# EAGLE design vps-r2.0-20-with-description (EAGLE 6.6.0)
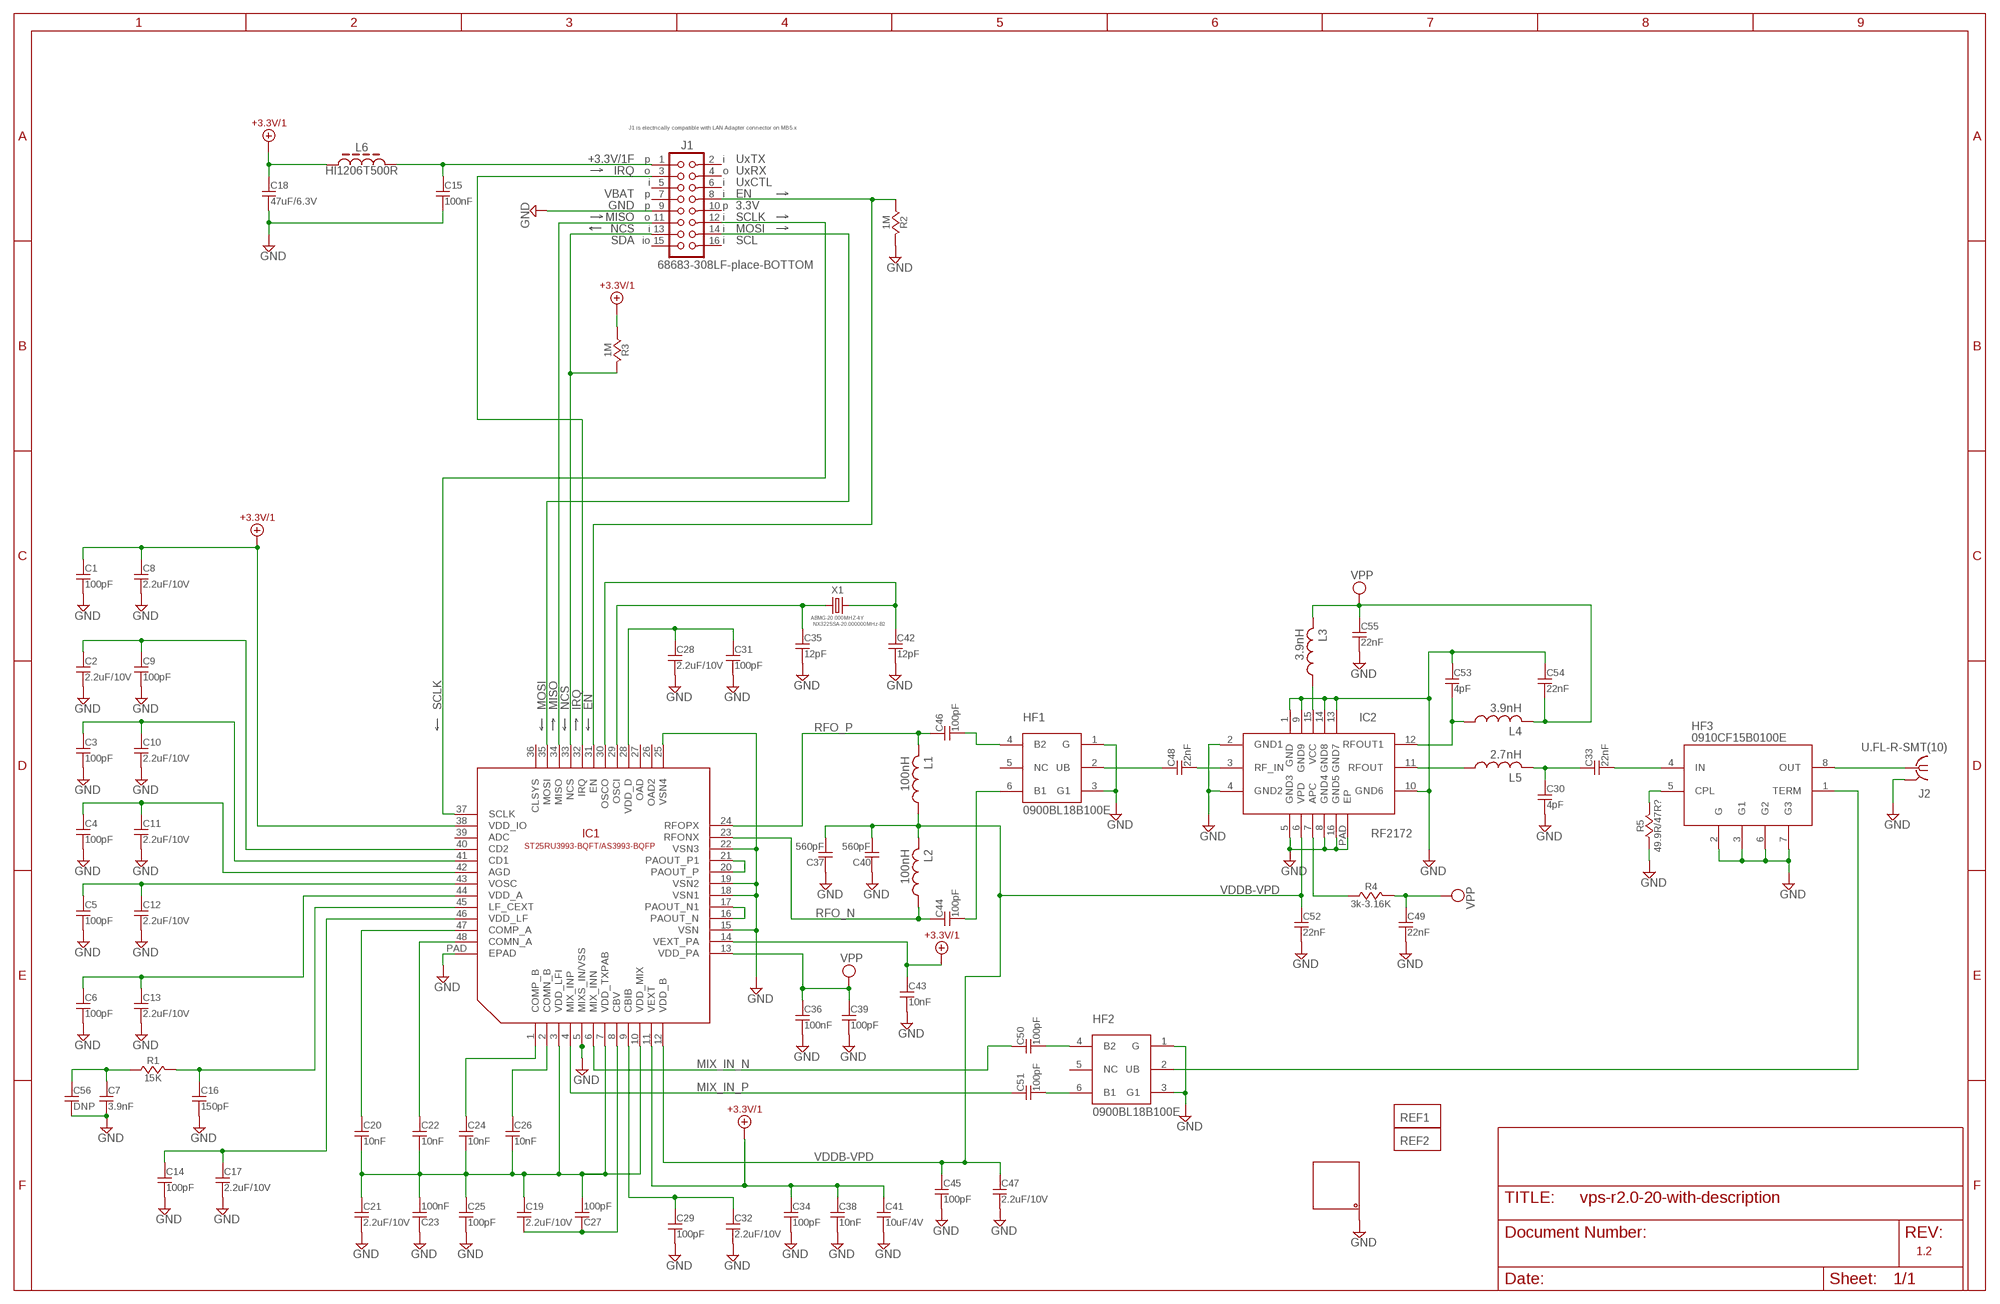
[diagram p0: schematic, sheet 1]

## Parts
C1  100pF  C-0603  [0603]
C2  2.2uF/10V  C-0603  [0603]
C3  100pF  C-0603  [0603]
C4  100pF  C-0603  [0603]
C5  100pF  C-0603  [0603]
C6  100pF  C-0603  [0603]
C7  3.9nF  C-0603  [0603]
C8  2.2uF/10V  C-0603  [0603]
C9  100pF  C-0603  [0603]
C10  2.2uF/10V  C-0603  [0603]
C11  2.2uF/10V  C-0603  [0603]
C12  2.2uF/10V  C-0603  [0603]
C13  2.2uF/10V  C-0603  [0603]
C14  100pF  C-0603  [0603]
C15  100nF  C-0603  [0603]
C16  150pF  C-0603  [0603]
C17  2.2uF/10V  C-0603  [0603]
C18  47uF/6.3V  C-1206  [1206]
C19  2.2uF/10V  C-0603  [0603]
C20  10nF  C-0603  [0603]
C21  2.2uF/10V  C-0603  [0603]
C22  10nF  C-0603  [0603]
C23  100nF  C-0603  [0603]
C24  10nF  C-0603  [0603]
C25  100pF  C-0603  [0603]
C26  10nF  C-0603  [0603]
C27  100pF  C-0603  [0603]
C28  2.2uF/10V  C-0603  [0603]
C29  100pF  C-0603  [0603]
C30  4pF  C-0603  [0603]
C31  100pF  C-0603  [0603]
C32  2.2uF/10V  C-0603  [0603]
C33  22nF  C-0603  [0603]
C34  100pF  C-0603  [0603]
C35  12pF  C-0603  [0603]
C36  100nF  C-0603  [0603]
C37  560pF  C-0603  [0603]
C38  10nF  C-0603  [0603]
C39  100pF  C-0603  [0603]
C40  560pF  C-0603  [0603]
C41  10uF/4V  C-0603  [0603]
C42  12pF  C-0603  [0603]
C43  10nF  C-0603  [0603]
C44  100pF  C-0603  [0603]
C45  100pF  C-0603  [0603]
C46  100pF  C-0603  [0603]
C47  2.2uF/10V  C-0603  [0603]
C48  22nF  C-0603  [0603]
C49  22nF  C-0603  [0603]
C50  100pF  C-0603  [0603]
C51  100pF  C-0603  [0603]
C52  22nF  C-0603  [0603]
C53  4pF  C-0603  [0603]
C54  22nF  C-0603  [0603]
C55  22nF  C-0603  [0603]
C56  DNP  C-0603  [0603]
HF1  0900BL18B100E  JTI_BALUN  [JTIBALUN]
HF2  0900BL18B100E  JTI_BALUN  [JTIBALUN]
HF3  0910CF15B0100E  JTI_CLP_FIL  [JTICPL]
IC1  ST25RU3993-BQFT/AS3993-BQFP  AS3993-BQFP  [LFCSP_7X7_48]
IC2  RF2172  [QFN164X4]
J1  68683-308LF-place-BOTTOM  MA08-2  [MA08-2]
J2  U.FL-R-SMT(10)  MC-921  [MC-921]
L1  100nH  L0603  [L0603]
L2  100nH  L0603  [L0603]
L3  3.9nH  L0603  [L0603]
L4  3.9nH  L0603  [L0603]
L5  2.7nH  L0603  [L0603]
L6  HI1206T500R  L-1206  [1206]
PCB1  PCB-VPS-1  [PCB-VPS]
R1  15K  R-0603  [0603]
R2  1M  R-0603  [0603]
R3  1M  R-0603  [0603]
R4  3k-3.16K  R-0603  [0603]
R5  49.9R/47R?  R-0603  [0603]
REF1  REF  [REF]
REF2  REF  [REF]
X1  ABMG-20.000MHZ-4Y  XTAL-7M  [7M]

## Nets
+3.3V/1: C1.1 C8.1 C18.1 C34.1 C38.1 C41.1 C43.1 IC1.11(VEXT) IC1.14(VEXT_PA) IC1.38(VDD_IO) L6.1 R3.1
+3.3V/1F: C15.1 J1.1 L6.2
APC: IC2.7(APC) R4.1
EN: IC1.31(EN) J1.8 R2.1
GND: C1.2 C2.2 C3.2 C4.2 C5.2 C6.2 C7.2 C8.2 C9.2 C10.2 C11.2 C12.2 C13.2 C14.2 C15.2 C16.2 C17.2 C18.2 C21.2 C23.1 C25.2 C28.2 C29.2 C30.2 C31.2 C32.2 C34.2 C35.2 C36.2 C37.1 C38.2 C39.2 C40.1 C41.2 C42.2 C43.2 C45.2 C47.2 C49.2 C52.2 C53.1 C54.1 C55.2 C56.2 HF1.1(G) HF1.3(G1) HF2.1(G) HF2.3(G1) HF3.2(G) HF3.3(G1) HF3.6(G2) HF3.7(G3) IC1.5(MIXS_IN/VSS) IC1.15(VSN) IC1.18(VSN1) IC1.19(VSN2) IC1.22(VSN3) IC1.25(VSN4) IC1.PAD(EPAD) IC2.1(GND) IC2.2(GND1) IC2.4(GND2) IC2.5(GND3) IC2.8(GND4) IC2.9(GND9) IC2.10(GND6) IC2.13(GND7) IC2.14(GND8) IC2.16(GND5) IC2.PAD(EP) J1.9 J2.2@1(GND) J2.2@2(GND) PCB1.VPS_PCB_1 R2.2 R5.1
IRQ: IC1.32(IRQ) J1.3
MISO: IC1.34(MISO) J1.11
MIX_IN_N: C50.1 IC1.6(MIX_INN)
MIX_IN_P: C51.1 IC1.4(MIX_INP)
MOSI: IC1.35(MOSI) J1.14
N$2: C7.1 C56.1 R1.1
N$3: C16.1 IC1.45(LF_CEXT) R1.2
N$4: C20.1 IC1.47(COMP_A)
N$5: C22.1 IC1.48(COMN_A)
N$8: C24.1 IC1.1(COMP_B)
N$9: C26.1 IC1.2(COMN_B)
N$11: C6.1 C13.1 IC1.44(VDD_A)
N$12: C5.1 C12.1 IC1.43(VOSC)
N$13: C19.2 C27.1 IC1.8(CBV)
N$14: C4.1 C11.1 IC1.42(AGD)
N$15: C14.1 C17.1 IC1.46(VDD_LF)
N$16: C3.1 C10.1 IC1.41(CD1)
N$17: C2.1 C9.1 IC1.40(CD2)
N$18 [100Ohm]: C51.2 HF2.6(B1)
N$19: C29.1 C32.1 IC1.9(CBIB)
N$22: C35.1 IC1.29(OSCI) X1.1
N$23: C42.1 IC1.30(OSCO) X1.3
N$24: IC1.20(PAOUT_P) IC1.21(PAOUT_P1)
N$25: IC1.16(PAOUT_N) IC1.17(PAOUT_N1)
N$29: C30.1 C33.1 L5.2
N$35: C33.2 HF3.4(IN)
N$39 [100Ohm]: C46.2 HF1.4(B2)
N$40: HF3.5(CPL) R5.2
N$41 [100Ohm]: C44.2 HF1.6(B1)
N$42: C48.1 HF1.2(UB)
N$44: HF2.2(UB) HF3.1(TERM)
N$46: HF3.8(OUT) J2.1
N$51: C28.1 C31.1 IC1.28(VDD_D)
N$52 [100Ohm]: C50.2 HF2.4(B2)
NCS: IC1.33(NCS) J1.13 R3.2
RFIN: C48.2 IC2.3(RF_IN)
RFO_N: C44.1 IC1.23(RFONX) L2.1
RFO_P: C46.1 IC1.24(RFOPX) L1.2
RFOUT: IC2.11(RFOUT) L5.1
RFOUT1: C53.2 IC2.12(RFOUT1) L4.1
SCLK: IC1.37(SCLK) J1.12
VDD-FLI-MIX-TXPAB: C19.1 C20.2 C21.1 C22.2 C23.2 C24.2 C25.1 C26.2 C27.2 IC1.3(VDD_LFI) IC1.7(VDD_TXPAB) IC1.10(VDD_MIX)
VDDB-VPD: C37.2 C40.2 C45.1 C47.1 C52.1 IC1.12(VDD_B) IC2.6(VPD) L1.1 L2.2
VPP: C36.1 C39.1 C49.1 C54.2 C55.1 IC1.13(VDD_PA) L3.2 L4.2 R4.2
VPP3,9NH: IC2.15(VCC) L3.1
Unconnected: HF1.5(NC) HF2.5(NC) IC1.26(OAD2) IC1.27(OAD) IC1.36(CLSYS) IC1.39(ADC) J1.2 J1.4 J1.5 J1.6 J1.7 J1.10 J1.15 J1.16

## Notes on the sheet
- J1 is electrically compatible with LAN Adapter connector on MB5.x
- p | i | UxTX
- o | o | UxRX
- i | i | UxCTL
- VBAT | p | i
- p | p | 3.3V
- o | i
- i | i
- SDA | io | i | SCL
- NX3225SA-20.000000MHz-B2
- 1.2

## Library data of the parts
C1-C17 C19-C56 = discrete:C-0603
C18 = discrete:C-1206: Capacitor 1206
HF1 HF2 = kits:JTI_BALUN: JTI 1:2 BALUN; DIGIKEY: 712-1023-1-ND; MF: JOHANSON TECHNOLIGIES; MPN: 0900BL18B100E
HF3 = JohansonTech-U:JTI_CLP_FIL: JTI 10dB CPLR/FILTER
IC1 = AustriaMicro-U:AS3993: RFID READER
IC2 = Rfmd-U:RF2172: RF PPOWER AMP
J1 = CON-pinHeader-AON:MA08-2
J2 = con-coax:MC-921: COAX. MICROWAVE CONNECTOR O/D diam 2.1 Source: www.tycoelectronics.com .. Electronics .. ENG_CD_1775146_A2.pdf; OC_FARNELL: unknown; OC_NEWARK: unknown
L1-L5 = kits:L0603
L6 = discrete:L-1206
PCB1 = ACB:PCB-VPS
R1-R5 = discrete:R-0603
REF1 REF2 = technol:REF
X1 = TXC_Tech-U:XTAL

## Net classes
0 default: width 0.2 mm, drill 0.3 mm, clearance 0.2 mm
1 100Ohm: width 0.4 mm, clearance 0.178 mm

## Board
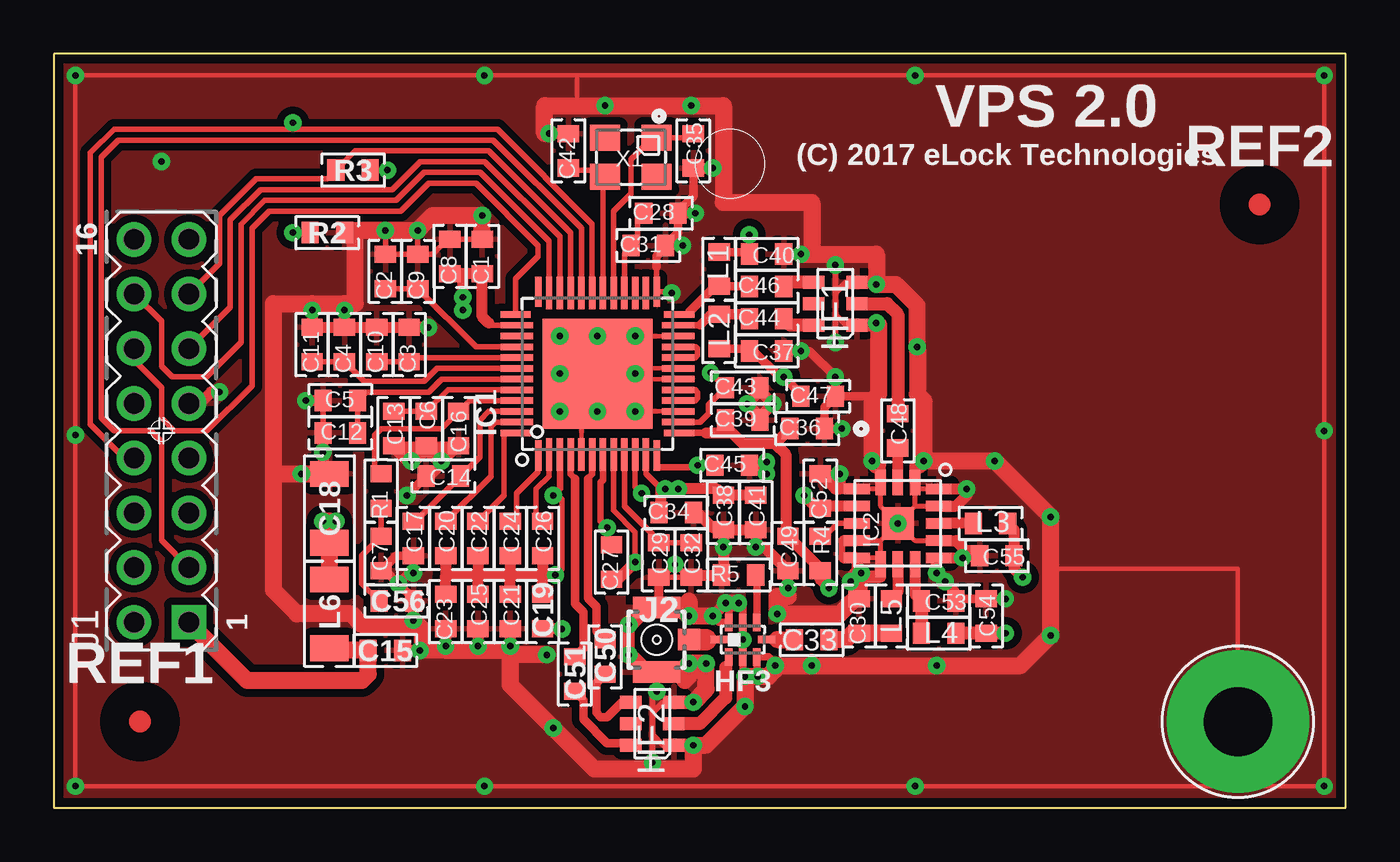
[diagram p1: board, top side]
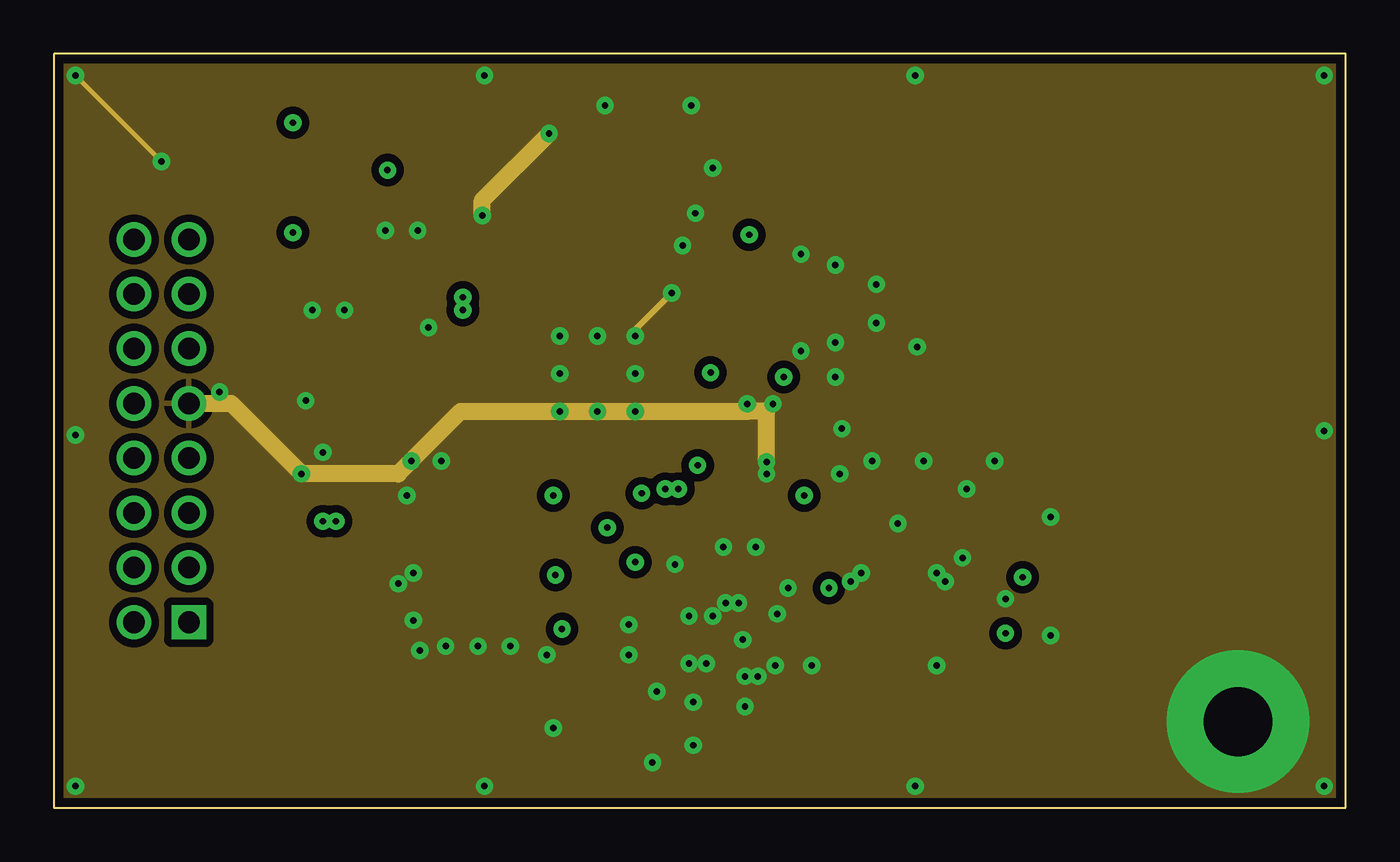
[diagram p2: board, inner layer Route2-GND]
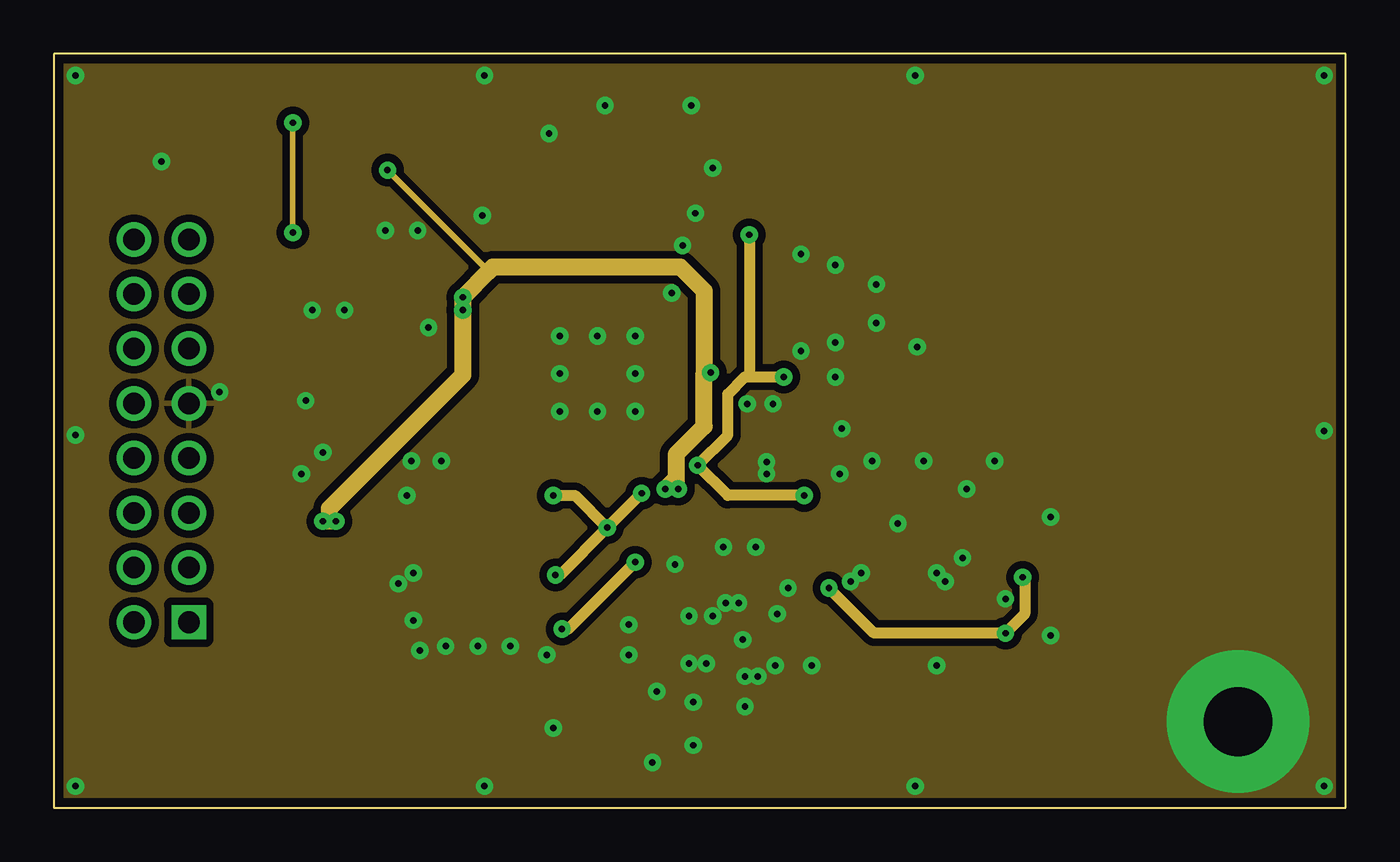
[diagram p3: board, inner layer Route15]
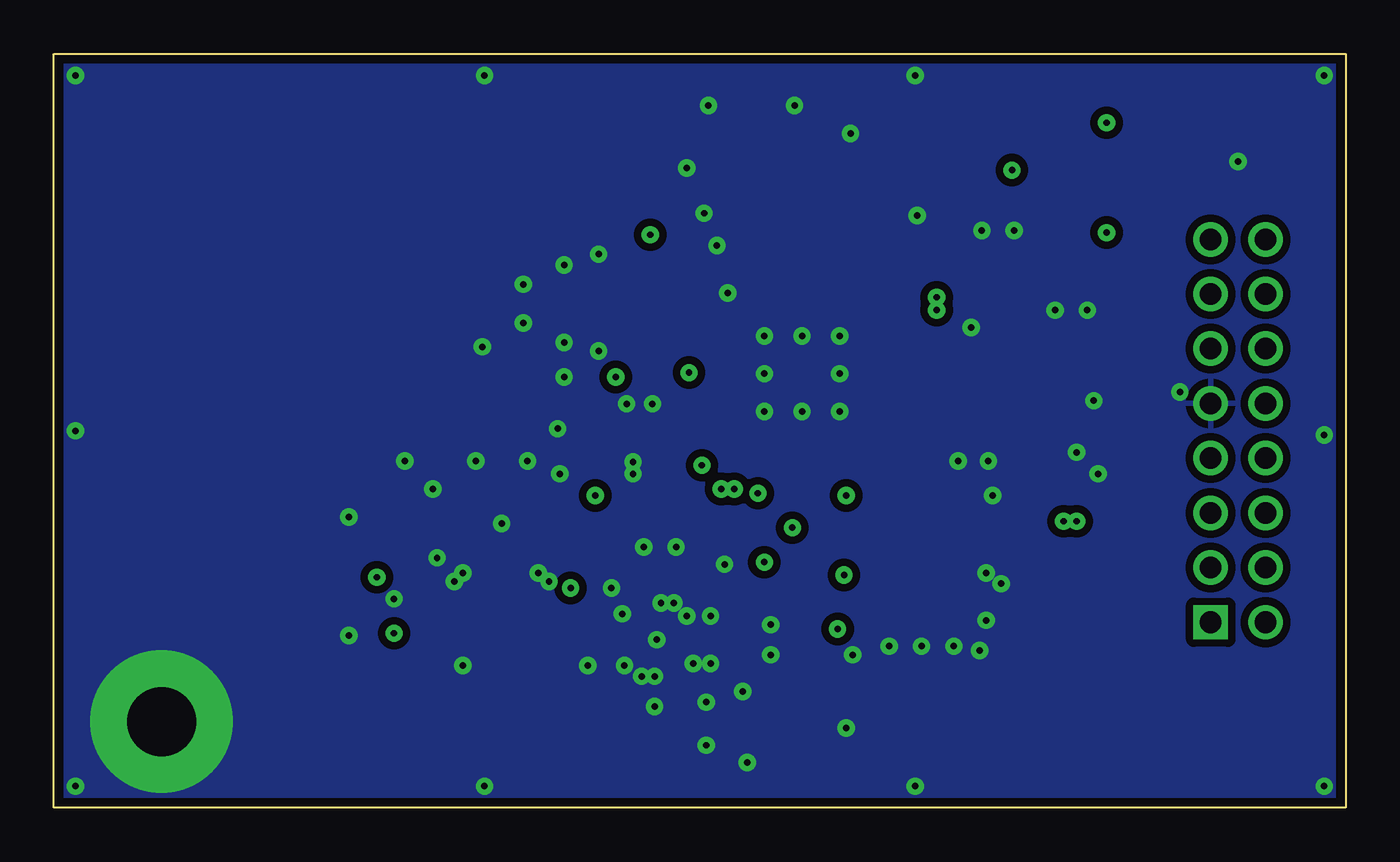
[diagram p4: board, bottom side, seen from below]

Size 60 x 35 mm. Coordinates in mm from the lower left corner, seen from the top.
Outline: 0,0 60,0 60,35 0,35 0,0
Copper layers ((1*2)+(15*16)): Top 0.035mm / dielectric 0.36mm / Route2-GND 0.035mm / dielectric 0.71mm / Route15 0.035mm / dielectric 0.36mm / Bottom 0.035mm
Design rules "default *": minimum track width 0.2mm, minimum drill 0.2mm, track to track 0.2mm, track to pad 0.2mm, pad to pad 0.2mm, via to via 0.2mm, smd to smd 0.001mm, copper to edge 0.4mm, drill to drill 0.25mm, minimum pad ring 0.25mm, minimum via ring 0.25mm, stop-mask expansion 4mil, vias tented up to drill 0.6mm, thermal gap 0.35mm

### Footprints (pad centres in the part's own frame; a part is rotated, then mirrored left to right if it is on the bottom)
0603 = smd 0.79 x 0.99: 1 -0.8,0; 2 0.8,0
1206 = smd 1.19 x 1.79: 1 -1.6,0; 2 1.6,0
JTIBALUN = smd 0.59 x 0.99: 1 1,1; 2 0,1; 3 -1,1; 4 -1,-1; 5 0,-1; 6 1,-1
JTICPL = smd 0.35 x 0.799: 1 0.65,0.8; 2 0,0.8; 3 -0.65,0.8; 5 -0.65,-0.8; 6 0,-0.8; 7 0.65,-0.8 | smd 0.799 x 0.35: 4 -1.1,0; 8 1.1,0
LFCSP_7X7_48 = smd 0.3 x 1.4: 1 -2.75,-3.8; 12 2.75,-3.8; 25 2.75,3.8; 36 -2.75,3.8 | smd 0.3 x 1.5: 2 -2.25,-3.75; 3 -1.75,-3.75; 4 -1.25,-3.75; 5 -0.75,-3.75; 6 -0.25,-3.75; 7 0.25,-3.75; 8 0.75,-3.75; 9 1.25,-3.75; 10 1.75,-3.75; 11 2.25,-3.75; 26 2.25,3.75; 27 1.75,3.75; 28 1.25,3.75; 29 0.75,3.75; 30 0.25,3.75; 31 -0.25,3.75; 32 -0.75,3.75; 33 -1.25,3.75; 34 -1.75,3.75; 35 -2.25,3.75 | smd 1.4 x 0.3: 13 3.8,-2.75; 24 3.8,2.75; 37 -3.8,2.75; 48 -3.8,-2.75 | smd 1.5 x 0.3: 14 3.75,-2.25; 15 3.75,-1.75; 16 3.75,-1.25; 17 3.75,-0.75; 18 3.75,-0.25; 19 3.75,0.25; 20 3.75,0.75; 21 3.75,1.25; 22 3.75,1.75; 23 3.75,2.25; 38 -3.75,2.25; 39 -3.75,1.75; 40 -3.75,1.25; 41 -3.75,0.75; 42 -3.75,0.25; 43 -3.75,-0.25; 44 -3.75,-0.75; 45 -3.75,-1.25; 46 -3.75,-1.75; 47 -3.75,-2.25 | smd 5.1 x 5.1: PAD 0,0
QFN164X4 = smd 0.49 x 1.19: 1 -1.6,1.9; 5 -1.6,-1.9; 6 -0.8,-1.9; 7 0,-1.9; 8 0.8,-1.9; 9 1.6,-1.9; 13 1.6,1.9; 14 0.8,1.9; 15 0,1.9; 16 -0.8,1.9 | smd 1.19 x 0.49: 2 -1.9,0.8; 3 -1.9,0; 4 -1.9,-0.8; 10 1.9,-0.8; 11 1.9,0; 12 1.9,0.8 | smd 1.5 x 1.5: PAD 0,0
MA08-2 = drill 1 pad 1.6 square: 1 -8.89,-1.27 | drill 1 pad 1.6: 2 -8.89,1.27; 3 -6.35,-1.27; 4 -6.35,1.27; 5 -3.81,-1.27; 6 -3.81,1.27; 7 -1.27,-1.27; 8 -1.27,1.27; 9 1.27,-1.27; 10 1.27,1.27; 11 3.81,-1.27; 12 3.81,1.27; 13 6.35,-1.27; 14 6.35,1.27; 15 8.89,-1.27; 16 8.89,1.27
MC-921 = smd 1 x 1: 1 0,1.5 | smd 0.99 x 2.19: 2@1 -1.5,0; 2@2 1.5,0
L0603 = smd 0.79 x 0.99: 1 -0.8,0; 2 0.8,0
PCB-VPS = drill 3.2 pad 6.6: VPS_PCB_1 55,4
7M = smd 1.399 x 1.199: 1 -1.2,-0.9; 2 1.2,-0.9; 3 1.2,0.9; 4 -1.2,0.9

### Placement (x,y rotation side)
C1  19.9,25.6 90 top
C2  15.4,24.9 90 top
C3  16.5,21.5 90 top
C4  13.5,21.5 90 top
C5  13.3,18.9 180 top
C6  17.3,17.6 270 top
C7  15.2,11.8 270 top
C8  18.4,25.6 90 top
C9  16.9,24.9 90 top
C10  15,21.5 90 top
C11  12,21.5 90 top
C12  13.3,17.4 180 top
C13  15.8,17.6 270 top
C14  18.1,15.4 180 top
C15  15.4,7.3 0 top
C16  18.8,17.6 270 top
C17  16.7,12.5 270 top
C18  12.8,13.9 90 top
C19  22.7,9.1 270 top
C20  18.2,12.5 270 top
C21  21.2,9.1 270 top
C22  19.7,12.5 270 top
C23  18.2,9.1 90 top
C24  21.2,12.5 270 top
C25  19.7,9.1 270 top
C26  22.7,12.5 270 top
C27  25.9,11.4 90 top
C28  28.2,27.6 0 top
C29  28.1,11.5 270 top
C30  37.4,8.9 90 top
C31  27.6,26.1 0 top
C32  29.6,11.5 270 top
C33  35.2,7.8 180 top
C34  28.9,13.7 0 top
C35  29.7,30.5 270 top
C36  35,17.6 0 top
C37  33.1,21.2 180 top
C38  31.1,13.7 270 top
C39  32,18 0 top
C40  33.1,25.7 180 top
C41  32.6,13.7 270 top
C42  23.9,30.5 90 top
C43  32,19.5 0 top
C44  33.1,22.7 0 top
C45  31.5,15.9 0 top
C46  33.1,24.2 0 top
C47  35.5,19.1 0 top
C48  39.2,17.5 270 top
C49  34.1,11.8 270 top
C50  25.6,7 270 top
C51  24.2,6.2 270 top
C52  35.6,14.7 90 top
C53  41.1,9.6 180 top
C54  43.3,8.9 270 top
C55  43.8,11.7 180 top
C56  15.9,9.6 0 top
HF1  36.3,23.4 270 top
HF2  27.8,3.9 270 top
HF3  32,7.8 180 top
IC1  25.25,20.15 0 top
IC2  39.2,13.2 270 top
J1  5,17.5 90 top
J2  28,7.8 270 top
L1  30.9,25 270 top
L2  30.9,22.1 270 top
L3  43.5,13.2 0 top
L4  41.1,8.1 0 top
L5  38.9,8.9 270 top
L6  12.8,9 270 top
PCB1  0,0 0 top
R1  15.2,14.7 90 top
R2  12.7,26.7 0 top
R3  13.9,29.6 180 top
R4  35.6,11.8 270 top
R5  31.8,10.8 0 top
REF1  4,4 0 top
REF2  56,28 0 top
X1  26.8,30.2 180 top

### Tracks (layer width: path | path; a pad name or v marks a point on that pad's centre or on a via)
+3.3V/1  (via drill 0.3 pad 0.8)
  Top 0.25: IC1.38 20.3,22.4 20.2,22.5 | IC1.11 27.5,15.5 28.2,14.8 | R3.1 v15.5,29.6 | IC1.14 30,17.9 30.4,18.3 30.4,18.7 C43.1 v30.5,20.2
  Top 0.5: C41.1 C38.1 30.8,14.8 v28.4,14.8 28.2,14.8 28.2,13.9 28.1,13.8 C34.1 | 19.91,24.8 C1.1 | C1.1 19,24.8 | 19,24.8 C8.1 | 20.2,22.5 19.9,22.8 C1.1 | 19,24.8 v19,23.7 v19,23.1
  Top 0.8: v13.1,13.3 v12.5,13.3 12.8,13.3 C18.1 L6.1
  Route15 0.25: v15.5,29.6 20.2,24.9
  Route15 0.8: 30.2,20.2 30.2,24 29.1,25.1 20.4,25.1 20.2,24.9 v19,23.7 19,20.1 12.8,13.9 12.8,13.3 | 30.2,20.2 v30.5,20.2 | 30.2,20.2 30.2,17.7 28.9,16.4 28.9,15.3 | v28.4,14.8 28.9,15.3 | 12.8,13.3 v12.5,13.3 | v13.1,13.3 12.8,13.3 | 28.9,15.3 28.9,14.9 v29,14.8
+3.3V/1F
  Top 0.8: J1.1 8.98,5.9 14.3,5.9 14.6,6.2 C15.1 12.9,7.3 L6.2
APC
  Top 0.2: 36,12.8 35.8,12.8 R4.1
  Top 0.25: IC2.7 36.4,13.2 36,12.8
EN  (via drill 0.3 pad 0.8)
  Top 0.25: IC1.31 25,27.1 20.6,31.5 11.1,31.5 | 11.1,31.5 2.8,31.5 1.7,30.4 1.7,17.8 3.27,16.23 J1.8 | R2.1 v11.1,26.7 | v11.1,31.8 11.1,31.5
  Route15 0.25: v11.1,26.7 v11.1,31.8
GND  (via drill 0.3 pad 0.8)
  Top 0.2: IC2.9 38.4,11.6 38.4,12.4 | IC2.8 38.4,12.4 | 38.4,12.4 IC2.PAD | IC2.14 40,12.4 IC2.PAD | IC2.4 38.4,14.8 | 38.4,14.8 38.4,14 IC2.PAD | IC2.2 40,14.8 | 40,14.8 40,14 | 40,14 IC2.PAD | IC2.5 38.4,14.8 | IC2.1 40,14.8 | IC2.16 40,14 | v37.5,10.9 38.4,10.9 | IC1.5 24.5,18.4 | IC1.15 v27,18.4 | IC1.19 27,20.4 | IC1.18 27,19.9 | IC1.22 v27,21.9 | PCB1.VPS_PCB_1 55,11.1 46.3,11.1 | 24.3,34 v20,34 v1,34 v1,17.3 v1,1 v20,1 v40,1 v59,1 v59,17.5 v59,34 v40,34 24.3,34 | 22.8,32.6 24.3,32.6 24.3,34
  Top 0.25: C12.2 C5.2 | C9.2 C2.2 v15.4,26.8 | C1.2 C8.2 18.3,26.4 17.6,25.7 C9.2 | v16.9,26.8 C9.2 | 28,25.1 IC1.25 28.65,23.95 v28.7,23.9 | 29.45,10.7 C29.2 28.25,10.7 v28.85,11.3 29.45,10.7 | 29,27.5 C28.2 29,27.7 | HF1.1 36.8,22.4 36.3,22.9 | 36.3,22.9 36.3,23.9 | 36.3,23.9 36.8,24.4 HF1.3 | 29.45,10.7 C32.2 | 28.39,25.99 28.39,26.09 C31.2 | 27.8,3.4 v27.8,2.1 27.8,1.8 | 27.8,3.4 27.8,4.4 | 27.8,4.4 27.8,5.2 v28,5.4 | 36.3,23.9 v36.3,25.2 | 36.3,22.9 v36.3,21.6 | 27.8,3.4 28.3,2.9 | 27.8,4.4 28.3,4.9
  Top 0.3: v25.25,18.4 24.5,18.4 v23.5,18.4 v23.5,20.15 v23.5,21.9 v25.25,21.9 v27,21.9 v27,20.15 | v27,20.15 27,19.9 v27,18.4 | 27,20.4 v27,20.15 | IC1.PAD v27,20.15 | C34.2 29.9,13.7 | 36.7,11.6 36.6,11.7 36.6,12.3 36.7,12.4
  Top 0.35: 32,6.2 HF3.2 v32,7.8 HF3.6 32,9.5 v31.8,9.5 | 31.35,9.5 HF3.7 | v30.6,8.9 30.9,8.6 31.3,8.6 | v33.5,6.6 33.5,6.7 33.2,7 HF3.3 32.65,6.15 v32.7,6.1 33,6.1 33.4,6.5
  Top 0.4: 28,25.1 28,25.6 28.39,25.99 | C55.2 42.7,12 42.3,12 42.2,12.1 v42.2,11.6 42.7,11.6 | 32.63,6.17 v32.7,6.1 | 32,6.2 v32.1,6.1 | v41,10.9 v41.4,10.5 41.9,10 41.9,9.7 C54.1 v44.2,9.7 | v37,10.5 37.4,10.5 | 29,27.5 29,26.7 C31.2 v29.2,26.1 | C35.2 29.7,28.4 29,27.7 | C37.1 v34.7,21.2 35.1,21.2 v36.3,20 C47.2 | v36.6,17.6 C36.2 35.8,18.6 C47.2 | C45.2 32.5,15.9 32.9,15.5 v33.1,15.5 | J2.2@1 28.1,9.3 C29.2 | C56.2 16.7,9.7 v16,10.4 | v16,10.4 15.4,11 C7.2 15.9,11.7 C17.2 v16.7,10.9 16.5,10.9 v16,10.4 | C13.2 C6.2 C16.2 | C47.2 38,19.1 38,18.9 | 41,11.6 IC2.13 | 32.9,15.9 32.95,15.9 v33.1,16.05 | v18,16.1 18,15.9 17.5,15.4 C14.2 v16.4,14.5
  Top 0.49: 38.4,15.9 38.2,16.1 v38,16.1 | 40,15.9 40.4,16.3
  Top 0.5: C23.1 v18.2,7.5 18.2,7.3 | C21.2 v21.2,7.5 21.2,7.3 | C25.2 v19.7,7.5 19.7,7.3 | C4.2 C11.2 v12,23.1 | C4.2 v13.5,23.1 | v17.4,22.3 C3.2 C10.2 C4.2 | C5.2 v11.7,18.9 | v16.7,8.7 C56.2 | 37.4,10.8 37.3,10.8 IC2.9 36.7,11.6 | IC2.13 v42.2,11.6 | IC2.14 41.9,12.4 42.2,12.1 | v31.2,9.5 v30.6,8.9 | 38.4,11.6 IC2.10 | v41,10.9 41,11.6 | IC2.5 36.5,14.8 | 36.5,14.8 36.3,14.8 35.85,15.25 | 35.85,15.25 C52.2 | C42.2 v23,31.3 | C35.2 v30.6,29.7 | IC2.4 38.4,15.9 | IC2.2 40,15.9 | 29.9,13.7 30.6,13 31,13 C38.2 | 32.8,18.15 v33.4,18.75 32.8,19.35 | C38.2 v31.1,12.1 31.1,10.8 R5.1 29.7,10.8 C32.2 | HF2.3 29.3,4.9 | HF2.1 29.3,2.9 | C38.2 C41.2 v32.6,12.1 33,12.1 C49.2 v34.1,10.2 34.1,9.8 | 12.5,15.5 v12.5,16.5 C12.2 | v29.8,27.6 C28.2 | 32.8,18.15 v32.2,18.75 32.8,19.35 | 32.8,18.15 C39.2 | 32.8,19.35 C43.2 | 32.9,15.9 C45.2 | 35.85,15.25 36.05,15.25 36.3,15.5 v36.5,15.5 36.5,14.8 | C15.2 v17,7.3 | C16.2 18.7,16.8 | C13.2 15.9,16.8 | C40.1 v34.7,25.7 | IC2.1 v42.4,14.8 42.4,14.5 41.9,14 IC2.16 | v7.7,19.3 7.3,19.3 6.77,18.77 J1.9 | v37.5,10.9 37.7,10.7 38.4,10.7 38.4,11.2 | 36.7,12.4 IC2.8
  Top 0.6: v26.7,7.1 v26.7,8.5 | v38.2,24.3 38.1,24.4 HF1.3 | v38.2,22.5 38.1,22.4 HF1.1 | 29.3,4.9 v29.7,4.9 | 29.3,2.9 v29.7,2.9 | 18.7,16.8 v18,16.1
  Top 0.8: C1.2 v19.9,27.5 17.6,27.5 v16.9,26.8 v15.4,26.8 14,26.8 14,26.7 | 10.2,15.5 10.2,23.4 12,23.4 | v12,23.1 12,23.4 | 12,23.4 13.5,23.4 | 14,26.7 14,23.4 13.5,23.4 | v38.2,22.5 38.3,22.4 38.3,19.2 38,18.9 v38,16.1 38.2,15.9 | v40.4,16.1 40.4,16.3 40.4,18.9 40.1,19.2 v40.1,21.4 40.1,23.3 39.1,24.3 v38.2,24.3 38.2,25.7 35.2,25.7 | v40.4,16.1 40.2,15.9 | v29.5,6.7 v30.3,6.7 30.3,5.5 v29.7,4.9 | v30.6,8.9 v29.5,8.9 | v26.7,7.1 27.5,6.3 27.55,6.3 27.57,6.33 27.98,6.33 J2.2@2 29.1,6.3 v29.5,6.7 | v26.7,8.5 27.5,9.3 J2.2@1 29.1,9.3 v29.5,8.9 | C53.1 41.9,9.7 | v13.5,23.1 13.5,23.4 | R2.2 14,26.7 | 29.5,9.6 v29.5,8.9 | 10.2,15.5 v11.5,15.5 12.5,15.5 C18.2 | v31.8,9.5 31.35,9.5 v31.2,9.5 | 34.1,9.8 33.6,9.8 v33.6,9 36.5,9 37.2,9.7 C30.2 37.4,10.5 37.4,10.8 v37.5,10.9 37.4,10.9 v37,10.5 | 17.1,7.3 18.2,7.3 19.7,7.3 21.2,7.3 21.2,7 | 17.1,7.3 17.1,8.3 v16.7,8.7 16.7,8.5 14.3,8.5 13.8,9 11.3,9 10.2,10.1 10.2,15.5 | 17.1,7.3 v17,7.3 | 15.9,16.8 v16.6,16.1 C6.2 v18,16.1 | v34.7,25.7 35.2,25.7 | v40.4,16.1 v43.7,16.1 v46.3,13.5 46.3,11.1 v46.3,8 44.9,6.6 v41,6.6 v35.2,6.6 33.7,6.6 33.2,6.1 v32.7,6.1 v32.1,6.1 v32.1,4.7 30.3,2.9 v29.7,2.9 29.7,1.8 27.8,1.8 25.1,1.8 v23.2,3.7 21.2,5.7 21.2,7 | v23,31.3 22.8,31.3 22.8,32.6 v25.6,32.6 v29.6,32.6 31.1,32.6 31.1,28.1 35.2,28.1 35.2,25.7 | v22.9,7.1 21.3,7.1 21.2,7 | v29.5,6.7 29.5,6.1 29.3,5.9
  Route2-GND 0.2: v5,30 v1,34
  Route2-GND 0.25: v28.7,23.9 27,22.2 v27,21.9
  Route2-GND 0.8: v19.9,27.5 19.9,28.2 v23,31.3 | J1.9 8.23,18.77 v11.5,15.5 16,15.5 v16.6,16.1 18.9,18.4 v27,18.4 32.2,18.4 | 32.2,18.4 v32.2,18.75 | v33.1,16.05 33.1,18.4 32.2,18.4
  other vias: 39.2,13.2
  pour Top (isolate 0.35): 0.5,0.5 0.5,34.5 59.5,34.5 59.5,0.5
  pour Route2-GND (isolate 0.35): 0.5,0.5 0.5,34.5 59.5,34.5 59.5,0.5
  pour Route15 (isolate 0.35): 0.5,0.5 0.5,34.5 59.5,34.5 59.5,0.5
  pour Bottom (isolate 0.35): 0.5,0.5 0.5,34.5 59.5,34.5 59.5,0.5
IRQ
  Top 0.25: IC1.32 24.5,26.9 20.4,31 3,31 2.2,30.2 2.2,18.1 2.8,17.5 4.5,17.5 5,17 5,12.42 J1.3
MISO
  Top 0.25: IC1.34 23.5,26.5 20,30 17,30 15.7,28.7 9.6,28.7 8.2,27.3 8.2,23.24 J1.11
MIX_IN_N
  Top 0.3: IC1.6 25,15.47 24.8,15.28
  Top 0.4: 24.8,15.28 24.8,9.72 25.2,9.33 25.2,8.2 C50.1
MIX_IN_P
  Top 0.3: IC1.4 24,15.47 24.2,15.28
  Top 0.4: 24.2,15.28 24.2,9.47 24.6,9.07 24.6,7.4 C51.1
MOSI
  Top 0.25: IC1.35 23,26.3 19.8,29.5 17.2,29.5 15.9,28.2 9.8,28.2 8.7,27.1 8.7,21.6 7.1,20 5.5,20 5,20.5 5,22.58 J1.14
N$2
  Top 0.25: R1.1 C7.1 14.3,11.7 14.3,10.4 C56.1
N$3
  Top 0.25: IC1.45 19.3,18.9 C16.1 18,17.6 15.2,17.6 14.9,17.3 14.9,16.3 14.9,16.09 14.9,15.8 R1.2
N$4
  Top 0.25: IC1.47 20.5,17.9 20.3,17.7 20.3,15.4 C20.1
N$5
  Top 0.25: IC1.48 20.9,17.4 20.9,14.5 C22.1
N$8
  Top 0.25: C24.1 21.1,13.4 21.5,13.4 21.5,14.6 22.5,15.6 IC1.1
N$9
  Top 0.25: IC1.2 23,15.4 22.4,14.8 22.4,13.6 C26.1
N$11
  Top 0.25: C13.1 C6.1 18.3,19.4 IC1.44
N$12
  Top 0.25: IC1.43 18,19.9 17.4,19.3 14.5,19.3 C5.1 C12.1
N$13  (via drill 0.3 pad 0.8)
  Top 0.25: IC1.8 26,13.8 27,12.8 v27,11.4
  Top 0.5: v23.6,8.3 C19.2 | C27.1 26.2,10.6 v27,11.4
  Route15 0.5: v23.6,8.3 23.9,8.3 v27,11.4
N$14
  Top 0.25: IC1.42 17.8,20.4 17.2,19.8 14.4,19.8 C4.1 C11.1
N$15
  Top 0.25: IC1.46 20.2,18.4 19.8,18 19.8,16.3 C14.1 16.8,13.3 C17.1
N$16
  Top 0.25: IC1.41 16.7,20.9 C3.1 C10.1
N$17
  Top 0.25: IC1.40 19.6,21.4 C9.1
  Top 0.254: C9.1 C2.1
N$18
  Top 0.4: C51.2 24.6,5 24.6,4.1 25.7,3 26.5,3 26.6,2.9 HF2.6
N$19
  Top 0.25: C32.1 C29.1 27.8,12.6 27.8,12.7 26.5,14 IC1.9
N$22
  Top 0.25: IC1.29 26,27.7 26.8,28.5 26.8,30.1 27.8,31.1 X1.1 29.5,31.1 C35.1
N$23
  Top 0.25: IC1.30 25.5,29.2 X1.3 25.3,29.6 24,29.6 C42.1
N$24
  Top 0.25: IC1.20 29.8,20.9 29.9,21 29.9,21.3 29.8,21.4 IC1.21
N$25
  Top 0.25: IC1.16 29.8,18.9 29.9,19 29.9,19.3 29.8,19.4 IC1.17
N$29
  Top 0.8: C33.1 36.8,7.8 37.1,8.1 C30.1 L5.2
N$35
  Top 0.35: HF3.4 33.6,7.8
  Top 0.8: 33.6,7.8 C33.2
N$39
  Top 0.6: HF1.4 34.1,24.4 C46.2
N$40
  Top 0.35: HF3.5 32.65,10.75 R5.2
N$41
  Top 0.6: HF1.6 34.2,22.4 C44.2
N$42
  Top 0.6: C48.1 39.2,22.9 38.7,23.4 HF1.2
N$44
  Top 0.35: HF3.1 31.35,6.65 31.2,6.5
  Top 0.5: 29.3,3.9 HF2.2
  Top 0.6: 31.2,6.5 31.2,5.1 30,3.9 29.3,3.9
N$46
  Top 0.35: HF3.8 30.5,7.8
  Top 0.6: 30.5,7.8 30.3,7.8
  Top 1: 30.3,7.8 J2.1
N$51
  Top 0.25: IC1.28 26.5,25.7 26.8,26 C31.1 27.1,26.4 27.1,27.2 27.4,27.5 C28.1
N$52
  Top 0.4: C50.2 25.2,5.8 25.2,4.4 25.4,4.2 25.7,4.2 26.4,4.9 HF2.4
NCS
  Top 0.25: IC1.33 24,26.7 20.2,30.5 14,30.5 R3.2 12.7,29.2 9.4,29.2 7.7,27.5 7.7,25.28 J1.13
RFIN
  Top 0.5: IC2.3 C48.2
RFO_N
  Top 0.3: IC1.23 30,22.4
  Top 0.4: 30,22.4 30.5,22.9 L2.1
  Top 0.48: L2.1 32.1,22.9 C44.1
RFO_P
  Top 0.3: IC1.24 29.5,22.9 29.5,23
  Top 0.4: 29.5,23 30.7,24.2 L1.2 C46.1
RFOUT
  Top 0.5: IC2.11 39.2,10 L5.1
RFOUT1
  Top 0.5: IC2.12 40,9.9 C53.2
  Top 0.6: C53.2 L4.1
SCLK
  Top 0.25: IC1.37 21.45,24.55 22.5,25.6 22.5,26.1 19.6,29 17.4,29 16.1,27.7 10,27.7 9.2,26.9 9.2,19.6 7.1,17.5 5.6,17.5 5,18.1 5,19.5 3.73,20.77 J1.12
VDD-FLI-MIX-TXPAB  (via drill 0.3 pad 0.8)
  Top 0.25: IC1.10 27,14.9 v27.3,14.6 | v23.3,10.8 23.6,11.1 23.6,14.3 23.4,14.5 v23.2,14.5 | v25.7,13 25.7,12.4 C27.2
  Top 0.3: IC1.7 25.5,15.2 25.4,15.1 25.4,13.3 v25.7,13 | IC1.3 23.5,14.8 v23.2,14.5
  Top 0.5: C25.1 19.7,10.8 | C23.2 18.2,10.8 | 19.7,10.8 21.2,10.8 | 18.2,10.8 19.7,10.8 | C20.2 18.2,10.8 | C22.2 19.7,10.8 | C21.1 21.2,10.8 | C24.2 21.2,10.8 | C19.1 22.7,10.8 | 22.7,10.8 21.2,10.8 | C26.2 22.7,10.8 | v23.3,10.8 22.7,10.8
  Route15 0.5: v25.7,13 v27.3,14.6 | v25.7,13 23.5,10.8 v23.3,10.8 | v23.2,14.5 24.2,14.5 v25.7,13
VDDB-VPD  (via drill 0.3 pad 0.8)
  Top 0.25: C52.1 35.5,13.9 | IC1.12 28,15.8
  Top 0.3: 28,15.8 29.8,15.8 v29.9,15.9 C45.1 | v32.3,26.6 C40.2
  Top 0.4: L1.1 32,25.8 32.1,25.7 C40.2 | L2.2 32.2,21.3 C37.2 32.5,21.2 33.7,20 v33.9,20 34.7,19.2 C47.1
  Top 0.5: IC2.6 35.7,14 C52.1 | 35.5,13.9 35.45,13.9 v34.85,14.5
  Route15 0.5: 32.3,20 32.1,20 31.3,19.2 31.3,17.3 v29.9,15.9 31.3,14.5 v34.85,14.5 | 32.3,20 v33.9,20 | v32.3,26.6 32.3,20
VPP  (via drill 0.3 pad 0.8)
  Top 0.3: IC1.13 30.3,17.4
  Top 0.5: 33.5,16.9 32,16.9 31.5,17.4 31.3,17.4 | L3.2 44.6,12.9 C55.1 44.6,11.1 v45,10.7 | 33.5,16.9 34,16.4 34,12.7 C49.1 35.6,11.1 R4.2 35.6,10.6 v36,10.2 | 33.5,16.9 C36.1 | 30.3,17.4 31.3,17.4 | C39.1 31.2,17.5 31.3,17.4
  Top 0.6: L4.2 C54.2 v44.2,8.1
  Route15 0.5: v45,10.7 45.1,10.7 45.1,9 v44.2,8.1 38.1,8.1 v36,10.2
VPP3,9NH
  Top 0.5: L3.1 IC2.15

### Text on the board
tPlace: VPS 2.0 | VPS 2.0 | (C) 2017 eLock Technologies
Document: All componets are in TOP except Dual row 16 pin connector. | Coaxial 2.0mm antena connector U.FL-R in TOP. | Dual row 16 pin connector in BOTTOM. It connects ACB1.0 and VPS2.0. / Electrically compatible with connector for LanAdapter on MB5.x. / It is possible to connect VPS2.0 to MB5.x for testing purporses. | Mounting hole 3.2mm for M3 screw. / Used for fixing VPS2.0 to ACB1.0.